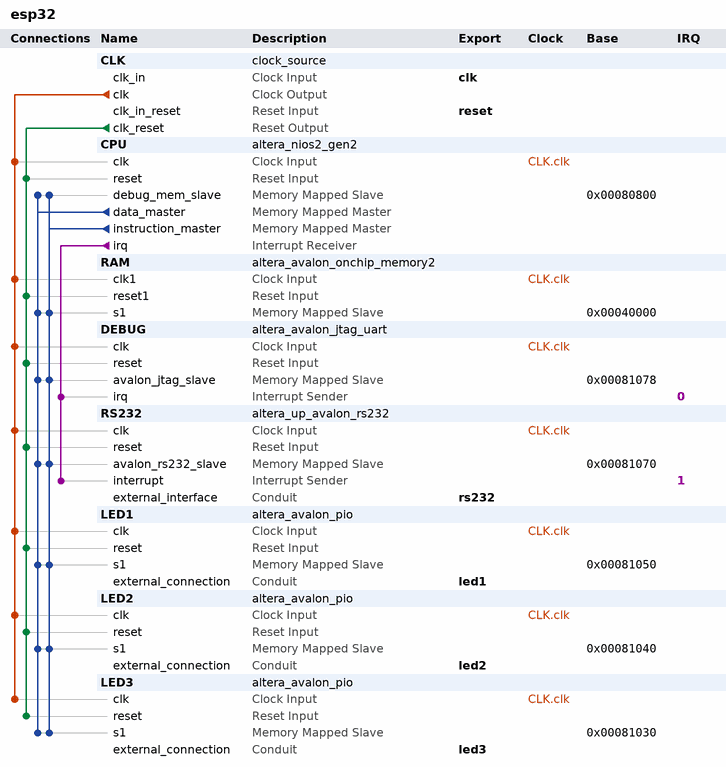
[diagram p0: system contents]
# Platform Designer (Qsys) system esp32, Cyclone IV E EP4CE115F29C7
# Parameters at their usual value, and those the tool derives, are not listed.
package require -exact qsys 17.1
create_system esp32
set_project_property DEVICE_FAMILY {Cyclone IV E}
set_project_property DEVICE EP4CE115F29C7

add_instance CLK clock_source 17.1
set_instance_parameter_value CLK clockFrequency 50000000

add_instance CPU altera_nios2_gen2 17.1
set_instance_parameter_value CPU dcache_size 2048
set_instance_parameter_value CPU exceptionSlave RAM.s1
set_instance_parameter_value CPU icache_size 4096
set_instance_parameter_value CPU impl Tiny
set_instance_parameter_value CPU resetSlave RAM.s1

add_instance RAM altera_avalon_onchip_memory2 17.1
set_instance_parameter_value RAM dataWidth 32
set_instance_parameter_value RAM dualPort false
set_instance_parameter_value RAM initMemContent true
set_instance_parameter_value RAM initializationFileName onchip_mem.hex
set_instance_parameter_value RAM memorySize 204800

add_instance DEBUG altera_avalon_jtag_uart 17.1
set_instance_parameter_value DEBUG simInteractiveOptions NO_INTERACTIVE_WINDOWS

add_instance RS232 altera_up_avalon_rs232 17.1
set_instance_parameter_value RS232 baud 9600
set_instance_parameter_value RS232 parity None

add_instance LED1 altera_avalon_pio 17.1
set_instance_parameter_value LED1 direction Output
set_instance_parameter_value LED1 width 1

add_instance LED2 altera_avalon_pio 17.1
set_instance_parameter_value LED2 direction Output
set_instance_parameter_value LED2 width 1

add_instance LED3 altera_avalon_pio 17.1
set_instance_parameter_value LED3 direction Output
set_instance_parameter_value LED3 width 1

# connections
add_connection CLK.clk CPU.clk clock
add_connection CLK.clk DEBUG.clk clock
add_connection CLK.clk LED1.clk clock
add_connection CLK.clk LED2.clk clock
add_connection CLK.clk LED3.clk clock
add_connection CLK.clk RAM.clk1 clock
add_connection CLK.clk RS232.clk clock
add_connection CLK.clk_reset CPU.reset reset
add_connection CLK.clk_reset DEBUG.reset reset
add_connection CLK.clk_reset LED1.reset reset
add_connection CLK.clk_reset LED2.reset reset
add_connection CLK.clk_reset LED3.reset reset
add_connection CLK.clk_reset RAM.reset1 reset
add_connection CLK.clk_reset RS232.reset reset
add_connection CPU.data_master CPU.debug_mem_slave avalon
set_connection_parameter_value CPU.data_master/CPU.debug_mem_slave baseAddress 0x00080800
add_connection CPU.data_master DEBUG.avalon_jtag_slave avalon
set_connection_parameter_value CPU.data_master/DEBUG.avalon_jtag_slave baseAddress 0x00081078
add_connection CPU.data_master LED1.s1 avalon
set_connection_parameter_value CPU.data_master/LED1.s1 baseAddress 0x00081050
add_connection CPU.data_master LED2.s1 avalon
set_connection_parameter_value CPU.data_master/LED2.s1 baseAddress 0x00081040
add_connection CPU.data_master LED3.s1 avalon
set_connection_parameter_value CPU.data_master/LED3.s1 baseAddress 0x00081030
add_connection CPU.data_master RAM.s1 avalon
set_connection_parameter_value CPU.data_master/RAM.s1 baseAddress 0x00040000
add_connection CPU.data_master RS232.avalon_rs232_slave avalon
set_connection_parameter_value CPU.data_master/RS232.avalon_rs232_slave baseAddress 0x00081070
add_connection CPU.instruction_master CPU.debug_mem_slave avalon
set_connection_parameter_value CPU.instruction_master/CPU.debug_mem_slave baseAddress 0x00080800
add_connection CPU.instruction_master DEBUG.avalon_jtag_slave avalon
set_connection_parameter_value CPU.instruction_master/DEBUG.avalon_jtag_slave baseAddress 0x00081078
add_connection CPU.instruction_master LED1.s1 avalon
set_connection_parameter_value CPU.instruction_master/LED1.s1 baseAddress 0x00081050
add_connection CPU.instruction_master LED2.s1 avalon
set_connection_parameter_value CPU.instruction_master/LED2.s1 baseAddress 0x00081040
add_connection CPU.instruction_master LED3.s1 avalon
set_connection_parameter_value CPU.instruction_master/LED3.s1 baseAddress 0x00081030
add_connection CPU.instruction_master RAM.s1 avalon
set_connection_parameter_value CPU.instruction_master/RAM.s1 baseAddress 0x00040000
add_connection CPU.instruction_master RS232.avalon_rs232_slave avalon
set_connection_parameter_value CPU.instruction_master/RS232.avalon_rs232_slave baseAddress 0x00081070
add_connection CPU.irq DEBUG.irq interrupt
set_connection_parameter_value CPU.irq/DEBUG.irq irqNumber 0
add_connection CPU.irq RS232.interrupt interrupt
set_connection_parameter_value CPU.irq/RS232.interrupt irqNumber 1

# exported interfaces
add_interface clk clock sink
set_interface_property clk EXPORT_OF CLK.clk_in
add_interface led1 conduit end
set_interface_property led1 EXPORT_OF LED1.external_connection
add_interface led2 conduit end
set_interface_property led2 EXPORT_OF LED2.external_connection
add_interface led3 conduit end
set_interface_property led3 EXPORT_OF LED3.external_connection
add_interface reset reset sink
set_interface_property reset EXPORT_OF CLK.clk_in_reset
add_interface rs232 conduit end
set_interface_property rs232 EXPORT_OF RS232.external_interface

set_interconnect_requirement {$system} qsys_mm.clockCrossingAdapter HANDSHAKE
set_interconnect_requirement {$system} qsys_mm.enableEccProtection FALSE
set_interconnect_requirement {$system} qsys_mm.insertDefaultSlave FALSE
set_interconnect_requirement {$system} qsys_mm.maxAdditionalLatency 1

save_system esp32.qsys
